# Altium schematic sheet Sheet2.SchDoc
size A4; SheetNumber: 1; SheetTotal: 1
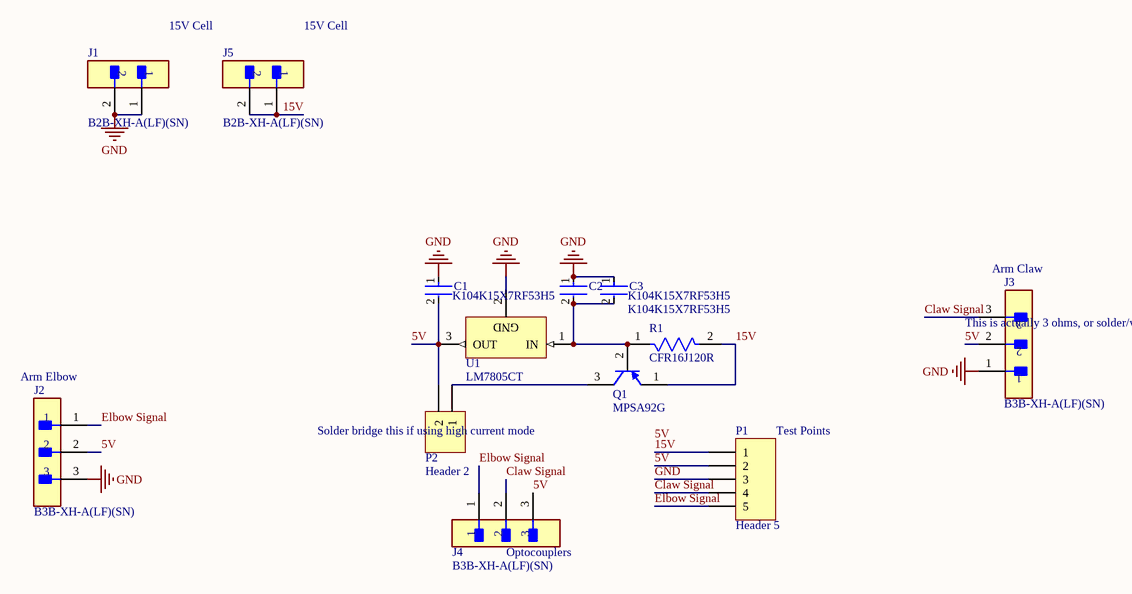
[diagram p0: Sheet2.SchDoc]

## Parts
C1  K104K15X7RF53H5  [FP-K15H5-MFG]
C2  K104K15X7RF53H5  [FP-K15H5-MFG]
C3  K104K15X7RF53H5  [FP-K15H5-MFG]
J1  B2B-XH-A(LF)(SN)  [FP-B2B-XH-A_LF_SN-MFG]
J2  B3B-XH-A(LF)(SN)  [FP-B3B-XH-A_LF_SN-MFG]
J3  B3B-XH-A(LF)(SN)  [FP-B3B-XH-A_LF_SN-MFG]
J4  B3B-XH-A(LF)(SN)  [FP-B3B-XH-A_LF_SN-MFG]
J5  B2B-XH-A(LF)(SN)  [FP-B2B-XH-A_LF_SN-MFG]
P1  Header 5  [HDR1X5]
P2  Header 2  [HDR1X2]
Q1  MPSA92G  [ONSC-TO-92-3-29-11]
R1  CFR16J120R  [FP-CFR16-MFG]
U1  LM7805CT  [FAIR-TO-220-3]

## Nets
GND: C1.1 C2.1 C3.1 J1.1 J1.2 J2.3 J3.1 P1.3 U1.2(GND)
5V: C1.2 J2.2 J3.2 J4.3 P1.2 P2.2 U1.3(OUT)
15V: J5.1 J5.2 P1.1 Q1.1(E) R1.2
Claw Signal: J3.3 J4.2 P1.4
Elbow Signal: J2.1 J4.1 P1.5
NetC2_2: C2.2 C3.2 Q1.2(B) R1.1 U1.1(IN)
NetP2_1: P2.1 Q1.3(C)

## Notes on the sheet
- 15V Cell
- (near J3) Arm Claw
- (near U1) This is actually 3 ohms, or solder/wire bridge if not using high voltage mode
- (near J2) Arm Elbow
- (near P2) Solder bridge this if using high current mode
- (near P1) Test Points
- (near J4) Optocouplers
- Labels drawn without touching a wire or pin: 5V

## Library data of the parts
C1-C3 = CMP-02417-000048-1: CAP CER 0.1UF 50V X7R RADIAL; Capacitance: 100nF; Tolerance: 10%; Lead/Base Style: Formed Leads; Lead Length: 30mm; Lead Diameter: 0.5mm; Radiation Hardening: No; Lead Pitch: 5mm; Voltage: 50V; Mount: Through Hole; Package Quantity: 5000; Series: K; Case/Package: Dipped; Min Operating Temperature: -55°C; Depth: 2.5mm; Height - Seated (Max): 0.1inch; Voltage Rating (DC): 50V; Packaging: Bulk; RoHS Compliant: Yes; Construction: RADIAL; Thickness: 2.6mm; Max Operating Temperature: 125°C; Voltage Rating: 50V; Diameter: 500um; Dielectric: X7R; Width: 2.5mm; Length: 4mm; Weight: 0.005644oz; Termination: Radial; Height: 4mm
J1 J5 = CMP-2000-05888-3: CONN HEADER VERT 2POS 2.5MM; Current Rating: 3A; Voltage Rating: 250V; Number of Contacts: 2; Contact Resistance: 20mR; Wire/Cable Gauge: 22AWG; Insulation Resistance: 1GR; Connector Type: Male Pin; Packaging: Bulk; Contact Material: Brass; Lead Free: Lead Free; Orientation: Straight; Contact Plating: Tin; Max Current Rating: 3A; Termination: Solder; Fastening Type: Detent; Depth: 5.75mm; Housing Material: Polyamide; REACH SVHC: No SVHC; Series: XH; Voltage Rating (AC): 250V; Number of Positions: 2; Color: Natural; Contact Type: Male Pin; Max Voltage Rating (DC): 250V; Pitch: 2.5mm; Lead Pitch: 2.5mm; Mount: Through Hole; Max Operating Temperature: 85°C; Length: 7.4mm; Max Voltage Rating (AC): 250V; Min Operating Temperature: -25°C; Number of Rows: 1; Housing Color: White
J2-J4 = CMP-17439-000014-2: CONN HEADER VERT 3POS 2.5MM; Number of Positions: 3; Contact Resistance: 20mR; Max Current Rating: 3A; Gender: Male; Wire/Cable Gauge: 22AWG; Insulation Resistance: 1GR; Max Voltage Rating (DC): 250V; REACH SVHC: No SVHC; Lead Free: Lead Free; Packaging: Bulk; Pitch: 2.5mm; Housing Color: White; Number of Rows: 1; Housing Material: Polyamide; Termination: Solder; Series: XH; Fastening Type: Detent; Contact Plating: Tin; Contact Finish - Mating: TIN; Insulation Material: Nylon; Number of Contacts: 3; Max Operating Temperature: 85°C; Color: Natural; Contact Type: Male Pin; Mount: Through Hole; Current Rating: 3A; Orientation: Straight; Min Operating Temperature: -25°C; Connector Type: Header; Lead Pitch: 2.5mm; Contact Material: Brass; Length: 9.9mm; Insulation Color: Natural; Voltage Rating (AC): 250V; Max Voltage Rating (AC): 250V; Contact Shape: Square; Flammability Rating: UL94 V-0; Depth: 5.75mm; Voltage Rating: 250V
P1 = Header 5: Header, 5-Pin; LatestRevisionDate: 17-Jul-2002; LatestRevisionNote: Re-released for DXP Platform.; Publisher: Altium Limited
P2 = Header 2: Header, 2-Pin; LatestRevisionDate: 17-Jul-2002; LatestRevisionNote: Re-released for DXP Platform.; Publisher: Altium Limited
Q1 = CMP-1048-01408-1: High Voltage Transistor, PNP Silicon, 3-Pin TO-92, Pb-Free, Bulk Box; Manufacturer: On Semiconductor; IC Continuous (A): -0.5; fT Min (MHz): 50; DatasheetVersion: Rev. 6; ComponentLink2Description: Datasheet; PackageReference: TO-92-3-29-11_AM_SL; Polarity: PNP; RoHS: TRUE; ComponentLink3Description: Package Specification; PackageDescription: 3-Pin Transistor Outline, Body 4.825 x 3.685 mm, Pitch 1.27 mm; ComponentLink3URL: http://www.onsemi.cn/pub_link/Collateral/2N6426-D.PDF; Packing: Bulk Box; ComponentLink1Description: Manufacturer URL; PartNumber: MPSA92G; ComponentLink1URL: http://www.onsemi.com/; Mounting Technology: Through Hole; ComponentLink2URL: http://www.onsemi.cn/pub_link/Collateral/MPSA92-D.PDF; PackageVersion: Rev. AM
R1 = CMP-03212-000007-1: RES 120 OHM 1/4W 5% AXIAL; Resistance: 120R; Power Rating: 250mW; Number of Resistors: 1; Voltage Rating: 200V; Temperature Coefficient: 0ppm/°C; RoHS Compliant: Yes; Mount: Axial; Package Quantity: 5000; Diameter: 1.85mm; Number of Terminations: 2; Packaging: Cut Tape; Max Operating Temperature: 155°C; Resistance Tolerance: 5%; Termination: Axial; Length: 3.5mm; Max Power Dissipation: 250mW; Min Operating Temperature: -55°C; Resistor Type: Thin Film; Technology: CARBON FILM; Case/Package: Axial; Tolerance: 5%; Series: CFR16, Neohm; Voltage Rating (DC): 200V; ELV: Compliant; REACH SVHC: No SVHC
U1 = CMP-2000-04938-1: Positive Voltage Regulator, 5 V, 1 A, -40 to 125 degC, 3-Pin TO-220, RoHS, Tube; Manufacturer: FairchildSemiconductor; Maximum Input Voltage: 35V; Maximum Quiescent Current: 8mA; Load Regulation: 100mV; Maximum Output Current: 2.2(Typ)A; Output Type: Fixed; Typical Dropout Voltage @ Current: 2@1AV; Rad Hard: No; Output Voltage: 5V; Accuracy: ±4%; Number of Outputs: 1; Category: LinearRegulator; Package Description: 3-Pin Through Hole Device, Body 10 x 4.5 mm, Pitch 2.54 mm; Packaging: Rail/Tube; Mounting: ThroughHole; Polarity: Positive; Manufacturer URL: https://www.fairchildsemi.com/; Line Regulation: 100mV; Datasheet Version: Aug-12; Datasheet URL: https://datasheet.ciiva.com/26904/lm7805ct-26904988.pdf; Package Reference: TO-220; Package URL: https://www.fairchildsemi.com/package-drawings/TO/TO220B03.pdf; Package: 3TO-220AB; Operating Temperature: -40to125degC; Type: Linear